# EAGLE design design_project_sch (EAGLE 9.2.2)
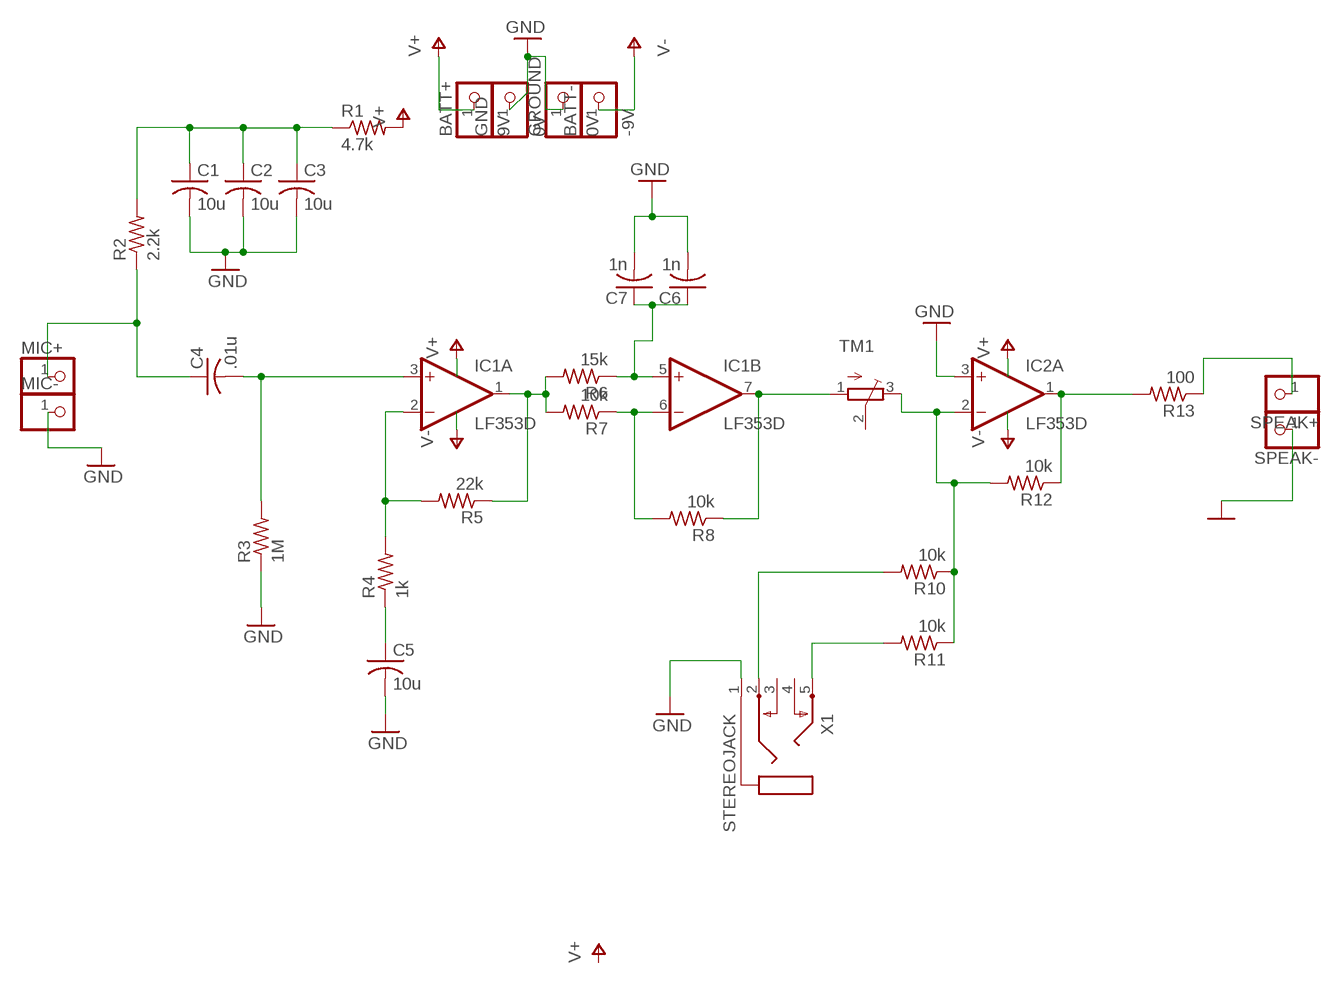
[diagram p0: schematic, sheet 1]

## Parts
BATT+  9V  PINHD-1X1  [1X01]
BATT-  -9V  PINHD-1X1  [1X01]
C1  10u  C-USC0805  [C0805]
C2  10u  C-USC0805  [C0805]
C3  10u  C-USC0805  [C0805]
C4  .01u  C-USC0805  [C0805]
C5  10u  C-USC0805  [C0805]
C6  1n  C-USC0805  [C0805]
C7  1n  C-USC0805  [C0805]
GND  0V  PINHD-1X1  [1X01]
GROUND  0V  PINHD-1X1  [1X01]
IC1  LF353D  [SO08]
IC2  LF353D  [SO08]
MIC+  PINHD-1X1  [1X01]
MIC-  PINHD-1X1  [1X01]
R1  4.7k  R-US_M0805  [M0805]
R2  2.2k  R-US_M0805  [M0805]
R3  1M  R-US_M0805  [M0805]
R4  1k  R-US_M0805  [M0805]
R5  22k  R-US_M0805  [M0805]
R6  15k  R-US_M0805  [M0805]
R7  10k  R-US_M0805  [M0805]
R8  10k  R-US_M0805  [M0805]
R10  10k  R-US_M0805  [M0805]
R11  10k  R-US_M0805  [M0805]
R12  10k  R-US_M0805  [M0805]
R13  100  R-US_M0805  [M0805]
SPEAK+  PINHD-1X1  [1X01]
SPEAK-  PINHD-1X1  [1X01]
TM1  TRIMPOT3386  [TRIM-3386]
X1  STEREOJACK  [STX3100]

## Nets
GND: C1.2 C2.2 C3.2 C5.2 C6.2 C7.2 GND.1 GROUND.1 IC2.3(A:+IN) MIC-.1 R3.1 SPEAK-.1 X1.1
N$1: C1.1 C2.1 C3.1 R1.1 R2.2
N$2: IC1.6(B:-IN) R7.1 R8.2
N$3: R10.2 X1.2
N$4: C4.1 MIC+.1 R2.1
N$5: IC2.2(A:-IN) R10.1 R11.1 R12.2 TM1.3(E)
N$6: C4.2 IC1.3(A:+IN) R3.2
N$7: IC1.2(A:-IN) R4.2 R5.2
N$8: C5.1 R4.1
N$9: IC1.1(A:OUT) R5.1 R6.2 R7.2
N$10: R11.2 X1.5
N$11: IC2.1(A:OUT) R12.1 R13.2
N$12: IC1.7(B:OUT) R8.1 TM1.1(A)
N$13: C6.1 C7.1 IC1.5(B:+IN) R6.1
N$14: R13.1 SPEAK+.1
V+: BATT+.1 R1.2
V-: BATT-.1
Unconnected: IC2.5(B:+IN) IC2.6(B:-IN) IC2.7(B:OUT) TM1.2(S) X1.3 X1.4

## Power pins joined to a net without a drawn wire
V+: IC1.8(P:V+) IC2.8(P:V+)
V-: IC1.4(P:V-) IC2.4(P:V-)

## Library data of the parts
BATT+ BATT- GND GROUND MIC+ MIC- SPEAK+ SPEAK- = adafruit:PINHD-1X1: Pin header 1x1 for 0.1" spacing With round pins
C1-C7 = adafruit:C-US: CAPACITOR, American symbol
IC1 IC2 = linear:LF353: OP AMP
R1-R8 R10-R13 = adafruit:R-US_: RESISTOR, American symbol
TM1 = adafruit:TRIMPOT: SMT trimmer potentiometer part number TC33X http://www.ladyada.net/library/eagle
X1 = adafruit:STEREOJACK: MIC/HEADPHONE JACK Stereo jack with two switches. Kycon STX3100, CUI SJ1-3555NG and/or 4UCon 05544

## Board
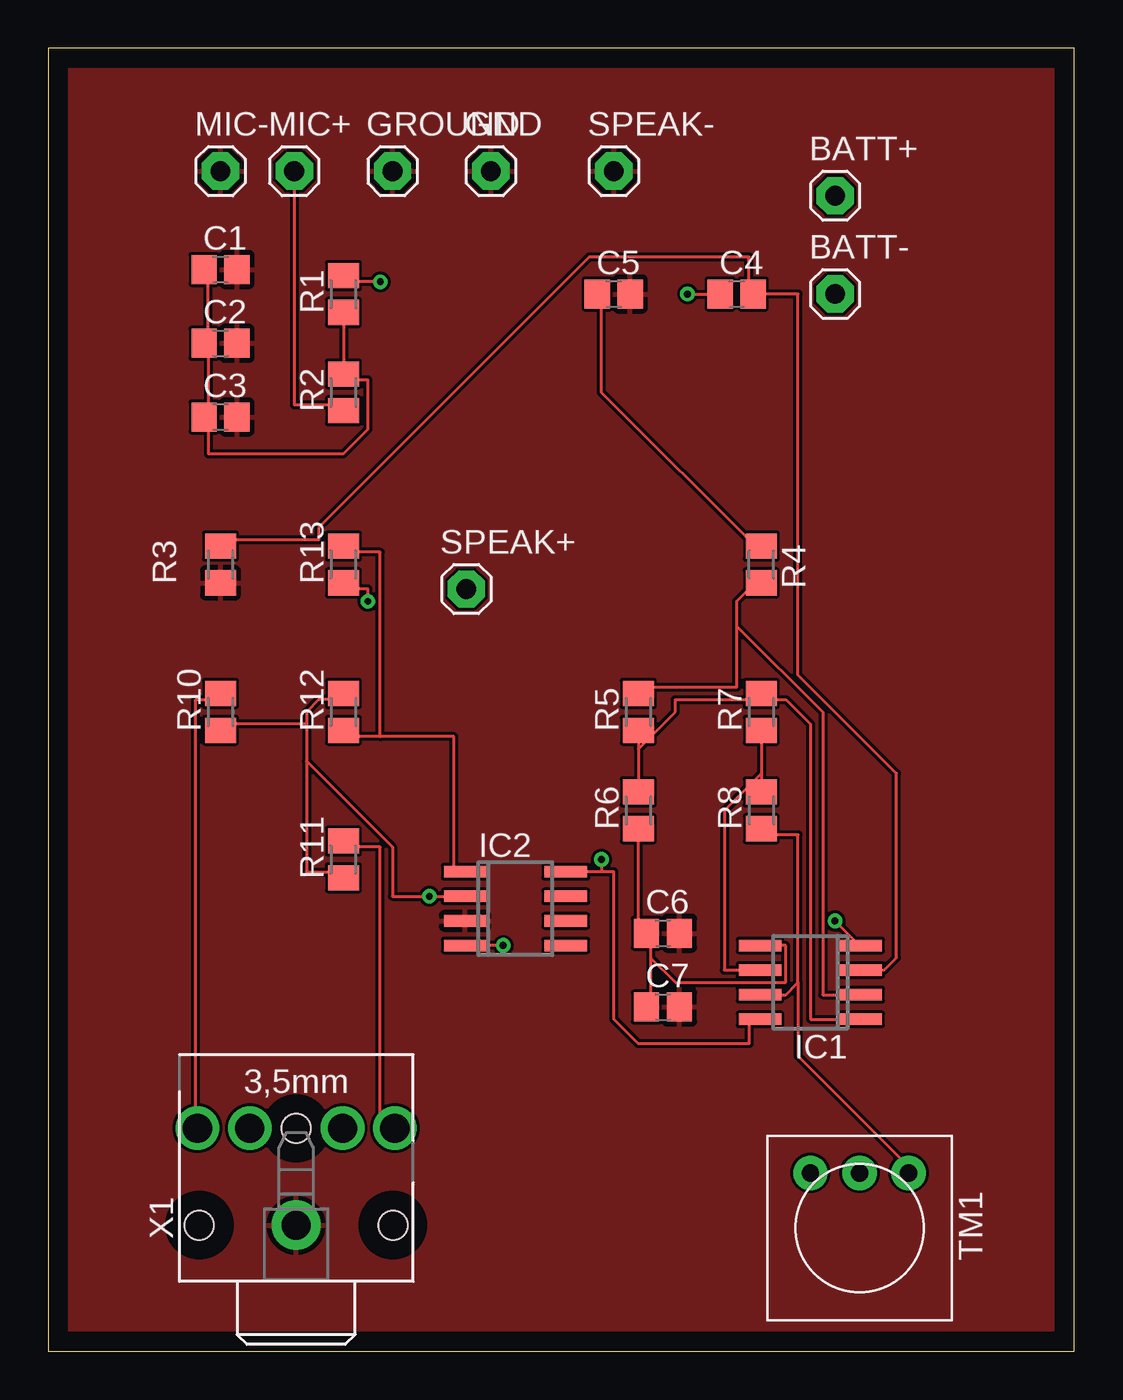
[diagram p1: board, top side]
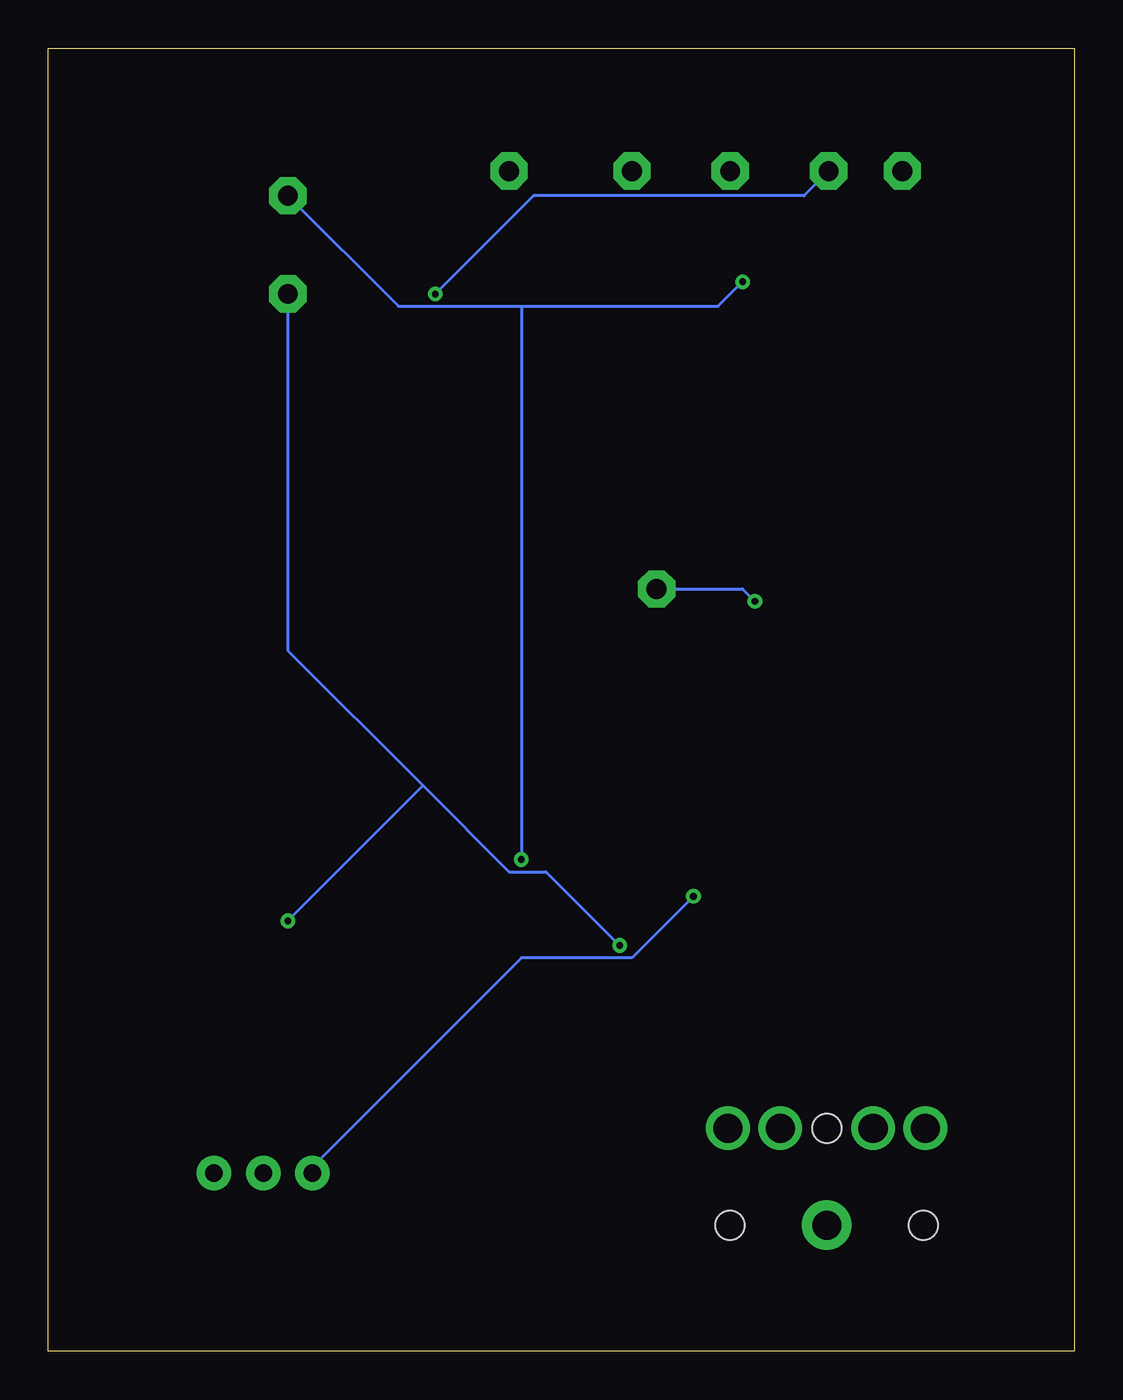
[diagram p2: board, bottom side, seen from below]

Size 53.01 x 67.3 mm. Coordinates in mm from the lower left corner, seen from the top.
Outline: 0,0 53.01,0 53.01,67.3 0,67.3 0,0
Copper layers (1*16): Top 0.035mm / dielectric 1.5mm / Bottom 0.035mm
Design rules "default": minimum track width 6mil, minimum drill 0.35mm, track to track 6mil, track to pad 6mil, pad to pad 6mil, via to via 6mil, smd to smd 6mil, copper to edge 40mil, drill to drill 6mil, minimum pad ring 10mil, minimum via ring 8mil, stop-mask expansion 4mil, vias tented up to drill 0mil, thermal gap 10mil

### Footprints (pad centres in the part's own frame; a part is rotated, then mirrored left to right if it is on the bottom)
1X01 = drill 1.016 pad 1.93 octagon: 1 0,0
C0805 = smd 1.3 x 1.5: 1 -0.85,0; 2 0.85,0
SO08 = smd 0.6 x 2.2: 1 -1.905,-2.6; 2 -0.635,-2.6; 3 0.635,-2.6; 4 1.905,-2.6; 5 1.905,2.6; 6 0.635,2.6; 7 -0.635,2.6; 8 -1.905,2.6
M0805 = smd 1.3 x 1.6: 1 -0.95,0; 2 0.95,0
TRIM-3386 = drill 0.9 pad 1.778: 1 -2.54,-2.857; 2 0,-2.857; 3 2.54,-2.857
STX3100 = drill 1.5 pad 2.54: 1 2.7,-0.1 | drill 1.5: 2 7.7,5; 3 7.7,2.3; 4 7.7,-2.5; 5 7.7,-5.2 | hole 1.5: 2.7,4.9; 2.7,-5.1; 7.7,-0.1

### Placement (x,y rotation side)
BATT+  40.64,59.69 0 top
BATT-  40.64,54.61 0 top
C1  8.89,55.88 0 top
C2  8.89,52.07 0 top
C3  8.89,48.26 0 top
C4  35.56,54.61 0 top
C5  29.21,54.61 0 top
C6  31.75,21.59 0 top
C7  31.75,17.78 0 top
GND  22.86,60.96 0 top
GROUND  17.78,60.96 0 top
IC1  39.37,19.05 90 top
IC2  24.13,22.86 270 top
MIC+  12.7,60.96 0 top
MIC-  8.89,60.96 0 top
R1  15.24,54.61 90 top
R2  15.24,49.53 90 top
R3  8.89,40.64 90 top
R4  36.83,40.64 270 top
R5  30.48,33.02 90 top
R6  30.48,27.94 90 top
R7  36.83,33.02 90 top
R8  36.83,27.94 90 top
R10  8.89,33.02 90 top
R11  15.24,25.4 90 top
R12  15.24,33.02 90 top
R13  15.24,40.64 90 top
SPEAK+  21.59,39.37 0 top
SPEAK-  29.21,60.96 0 top
TM1  41.91,6.35 180 top
X1  12.7,3.81 90 top

### Tracks (layer width: path | path; a pad name or v marks a point on that pad's centre or on a via)
GND
  pour Top: -10.16,72.39 -10.16,-3.81 58.42,-3.81 58.42,72.39
N$1
  Top 0.152: R1.1 R2.2 15.24,50.16 16.51,50.16 16.51,47.62 15.24,46.35 8.26,46.35 8.26,48.26 | 8.26,52.07 8.26,48.26 | 8.26,52.07 8.26,55.88 C1.1 | 8.26,52.07 C2.1 | 8.26,48.26 C3.1
N$2
  Top 0.152: R7.1 36.83,29.84 | 36.83,29.84 R8.2 | IC1.6 34.92,19.68 34.92,27.94 36.83,29.84
N$3
  Top 0.152: R10.2 8.89,33.66 7.62,33.66 7.62,12.06 X1.2
N$4  (via drill 0.35)
  Top 0.152: v33.02,54.61 C4.1 | MIC+.1 12.7,48.9 15.24,48.9 R2.1
  Bottom 0.152: v33.02,54.61 27.94,59.69 13.97,59.69 MIC+.1
N$5  (via drill 0.35)
  Top 0.152: 13.34,32.38 8.89,32.38 R10.1 | 13.34,32.38 13.34,33.02 13.97,33.66 15.24,33.66 R12.2 | 13.34,32.38 13.34,30.48 | 13.34,30.48 13.34,24.77 15.24,24.77 R11.1 | IC2.2 v19.68,23.5 17.78,23.5 17.78,26.04 13.34,30.48
  Bottom 0.152: v19.68,23.5 22.86,20.32 28.57,20.32 39.37,9.53 TM1.3
N$6
  Top 0.152: IC1.3 43.18,19.68 43.81,20.32 43.81,29.84 38.73,34.92 38.73,54.61 C4.2 36.2,54.61 36.2,56.52 27.94,56.52 13.97,42.55 13.97,41.91 8.89,41.91 R3.2
N$7
  Top 0.152: 35.56,37.47 35.56,38.73 36.83,40.01 R4.2 | 35.56,37.47 35.56,34.29 30.48,34.29 R5.2 | IC1.2 40.01,18.41 40.01,33.02 35.56,37.47
N$8
  Top 0.152: C5.1 28.57,54.61 28.57,49.53 36.83,41.27 R4.1
N$9
  Top 0.152: R5.1 30.48,31.11 | 30.48,31.11 R6.2 | 36.83,33.66 32.38,33.66 32.38,33.02 30.48,31.11 | IC1.1 39.37,17.14 39.37,32.38 38.1,33.66 36.83,33.66 | 36.83,33.66 R7.2
N$10
  Top 0.152: R11.2 15.24,26.04 17.14,26.04 17.14,12.06 17.78,11.43 X1.5
N$11
  Top 0.152: 17.14,31.75 20.95,31.75 20.95,24.77 IC2.1 | 17.14,31.75 15.24,31.75 R12.1 | 17.14,31.75 17.14,41.27 15.24,41.27 R13.2
N$12
  Top 0.152: 38.73,19.05 38.73,26.67 36.83,26.67 R8.1 | 38.73,19.05 38.1,18.41 IC1.7 | 38.73,19.05 38.73,15.24 44.45,9.53 TM1.1
N$13
  Top 0.152: 31.11,20.32 31.11,21.59 C6.1 30.48,21.59 R6.1 | 31.11,20.32 31.11,17.78 C7.1 | IC1.5 38.1,20.95 38.1,19.05 32.38,19.05 31.11,20.32
N$14  (via drill 0.35)
  Top 0.152: v16.51,38.73 16.51,39.37 15.24,39.37 R13.1
  Bottom 0.152: v16.51,38.73 17.14,39.37 SPEAK+.1
V+  (via drill 0.35)
  Top 0.152: 28.57,24.77 29.21,24.77 29.21,17.14 30.48,15.88 36.2,15.88 36.2,17.14 IC1.8 | 28.57,24.77 IC2.8 | v17.14,55.24 15.24,55.24 R1.2 | v28.57,25.4 28.57,24.77
  Bottom 0.152: v17.14,55.24 18.41,53.98 28.57,53.98 | 28.57,53.98 34.92,53.98 BATT+.1 | 28.57,53.98 v28.57,25.4
V-  (via drill 0.35)
  Top 0.152: v23.5,20.95 IC2.4 | v40.64,22.23 41.91,20.95 IC1.4
  Bottom 0.152: v23.5,20.95 27.3,24.77 29.21,24.77 33.66,29.21 | 33.66,29.21 40.64,36.2 BATT-.1 | 33.66,29.21 v40.64,22.23